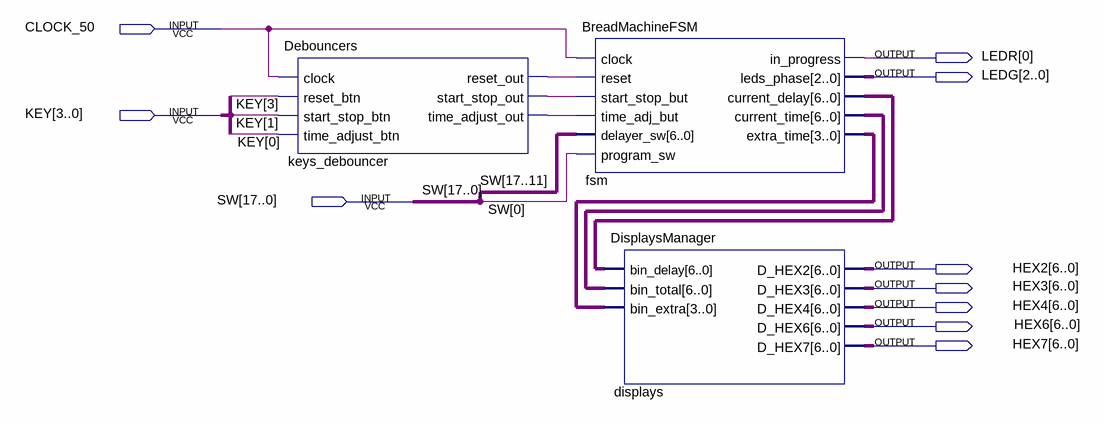
[diagram p0: schematic sheet]
// Quartus schematic BreadMachineBDF.bdf as structural Verilog: 3 symbols, 10 pins
module BreadMachineBDF (
  input  CLOCK_50,
  input  [3:0] KEY,
  input  [17:0] SW,
  output [0:0] LEDR,
  output [2:0] LEDG,
  output [6:0] HEX2,
  output [6:0] HEX3,
  output [6:0] HEX4,
  output [6:0] HEX6,
  output [6:0] HEX7
);

  wire keys_debouncer_reset_out, keys_debouncer_start_stop_out, keys_debouncer_time_adjust_out;
  wire [3:0] fsm_extra_time;
  wire [6:0] fsm_current_delay, fsm_current_time;

  Debouncers keys_debouncer (
    .clock(CLOCK_50), .reset_btn(KEY[3]), .start_stop_btn(KEY[1]), .time_adjust_btn(KEY[0]),
    .reset_out(keys_debouncer_reset_out), .start_stop_out(keys_debouncer_start_stop_out),
    .time_adjust_out(keys_debouncer_time_adjust_out));
  BreadMachineFSM fsm (
    .clock(CLOCK_50), .reset(keys_debouncer_reset_out), .start_stop_but(keys_debouncer_start_stop_out),
    .time_adj_but(keys_debouncer_time_adjust_out), .delayer_sw(SW[17:11]), .program_sw(SW[0]),
    .in_progress(LEDR[0]), .leds_phase(LEDG), .current_delay(fsm_current_delay),
    .current_time(fsm_current_time), .extra_time(fsm_extra_time));
  DisplaysManager displays (
    .bin_delay(fsm_current_delay), .bin_total(fsm_current_time), .bin_extra(fsm_extra_time), .D_HEX2(HEX2),
    .D_HEX3(HEX3), .D_HEX4(HEX4), .D_HEX6(HEX6), .D_HEX7(HEX7));
endmodule
